# Altium project PDB_01.PrjPcb
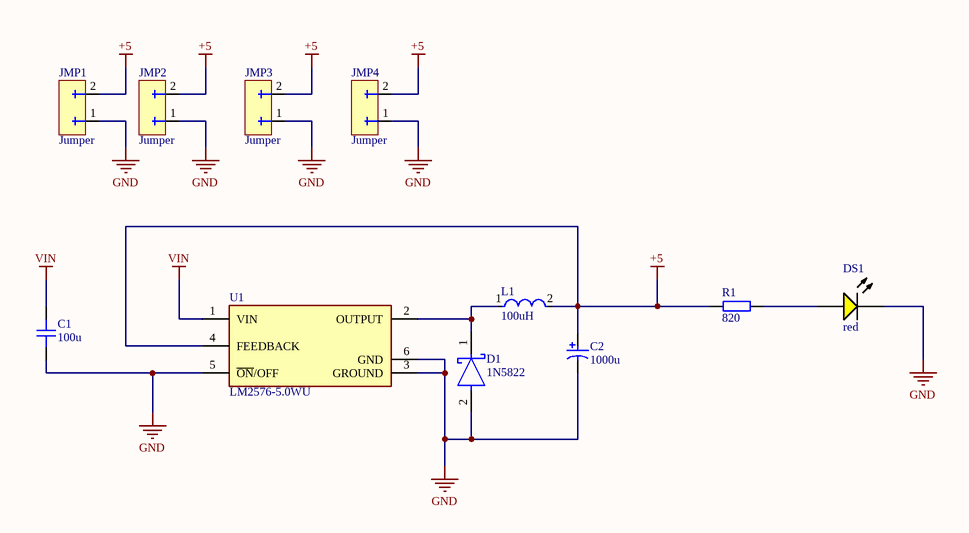
[diagram p0: Sheet2.SchDoc]
1 sheet, 11 parts. Net scope: global (net labels, ports and power ports of the same name join across sheets).
Board file: PCB1.PcbDoc

## Sheet Sheet2.SchDoc
size A4; SheetNumber: 1; SheetTotal: 1

### Parts
C1  100u  [CAP_1206]
C2  1000u  [NIC-UCL-10x13.5-2_V]
D1  1N5822  [FP-DO-201AD-MFG]
DS1  red  [LUMX-SML-LX1206YC-TR_V]
JMP1  Jumper  [JMP2_TH]
JMP2  Jumper  [JMP2_TH]
JMP3  Jumper  [JMP2_TH]
JMP4  Jumper  [JMP2_TH]
L1  100uH  [FP-IHLP-6767GZ-FP_3_825x1-MFG]
R1  820  [RES_1206]
U1  LM2576-5.0WU  [FP-TO263-5LD-PL-1-MFG]

### Nets
+5: C2.1 JMP1.2 JMP2.2 JMP3.2 JMP4.2 L1.2 R1.1 U1.4(FEEDBACK)
GND: C1.1 C2.2 D1.2(A) DS1.2(K) JMP1.1 JMP2.1 JMP3.1 JMP4.1 U1.3(GROUND) U1.5(~{ON}/OFF) U1.6(GND)
VIN: C1.2 U1.1(VIN)
NetD1_1: D1.1(C) L1.1 U1.2(OUTPUT)
NetDS1_1: DS1.1(A) R1.2

### Library data of the parts
C1 = CAP_1206: Capacitor SMD 1206; Manufacturer: *; Manufacturer Part Number: *; Distributor Link: *; LCSC: *; Rating: *; Dielectric: *
C2 = CMP-0926-00001-1: Aluminum Electrolytic Capacitor, Low Impedance, 1000 uF +/- 20%, 16 V, -55 to 105 degC, 2-Pin 10.3 x 10.3 x 13.5 mm SMD, RoHS, Reel; Manufacturer: Nichicon; PartNumber: UCL1C102MNL1GS; Rated Voltage: 16 V; Capacitance Tolerance: +/- 20%; Rated Capacitance: 1000 uF; Polarity Type: Polar; Impedance: 0.06 ohm; Leakage Current: 160 uA; Rated Ripple Current (at 100 kHz): 1190 mA; PackageReference: UCL-10x13.5-2; Mounting Technology: Surface Mount; PackageDescription: 2-Pin SMD, Body 10.3 x 10.3 mm, Height 14.3 mm; ComponentLink1Description: Manufacturer URL; ComponentLink2Description: Datasheet; RoHS: TRUE; DatasheetVersion: Sep-13; ComponentLink2URL: http://nichicon-us.com/english/products/pdfs/e-cl.pdf; ComponentLink1URL: www.nichicon.com; Packing: Reel; Category Temperature Range: -55 to 105 degC
D1 = CMP-12187-000025-1: DIODE SCHOTTKY 40V 3A DO201AD; Manufacturer: STMicroelectronics; Max Junction Temp: +150°C; Peak Reverse Current: 2mA; Max Surge Forward Current: 80A; Temperature Range High: +150°C; Automotive: No; RoHS: TRUE; ComponentLink2Description: Datasheet; Manufacturer Part Number: 1N5822; Lead Free: Yes; Octopart: https://octopart.com/1n5822-stmicroelectronics-323225; Device Class L2: Diodes; Max Repetitive Reverse Voltage: 40V; Temperature: to +150°C; Height: 5.3mm; Category: Diode; Digikey Description: DIODE SCHOTTKY 40V 3A DO201AD; ComponentLink2URL: https://www.st.com/resource/en/datasheet/1n5822.pdf; Device Class L3: Schottky Diodes; Device Class L1: Discrete Semiconductors; Forward Current: 3A; Mouser Description: Schottky Diodes & Rectifiers Vr/40V Io/3A BULK; Package: DO-201AD
DS1 = CMP-2000-07124-1: Yellow LED, Water Clear Len, 585 nm, 2.1 V, -40 to 85 degC, 2-Pin SMD, RoHS, Tape and Reel; Manufacturer: Lumex; Product Training Modules: LEDsBenefitsofCustomLEDandLCDTechnology; Millicandela Rating: 6mcd; Catalog Drawings: SML-LX1206SeriesTopSML-LX1206SeriesSideSML-LX1206SeriesBottomSML-LX1206SeriesFootprint; Wavelength - Peak: 585nm; Other Names: 67-1358-2LU60357TRSMLLX1206YCTR; Lens Style/Size: RectanglewithFlatTop; Current - Test: 20mA; Lens Color: Colorless; Viewing Angle: 160°; Voltage - Forward (Vf) (Typ): 2.1V; Online Catalog: SML-LX1206RectanglewithFlatTop1206PackageLEDs; Mounting Type: SurfaceMount; Package Description: 2-Pin Surface Mount Device, Body 3.2 x 1.5 mm; Datasheet Version: Rev. K, 08/2012; Features: -; Color: Yellow; RoHS Information: RoHSCertofCompliance; Package Reference: SML-LX1206YC-TR; Supplier Device Package: 1206; Standard Package: 3,000; Series: -; Wavelength - Dominant: -; Package / Case: 1206(3216Metric); Mounting Technology: SurfaceMount; Height (Max): 1.10mm; Lens Transparency: Clear; Datasheet URL: http://www.lumex.com/content/files/ProductAttachment/SML-LX1206YC-TR.pdf; Family: LEDIndication-Discrete; Manufacturer URL: http://www.lumexinstruments.com/; Packaging: Tape&Reel(TR); Category: Optoelectronics; Size / Dimension: 3.20mmLx1.60mmW
JMP1-JMP4 = JMP2_TH: Jumper 2 Pins Through-Hole DO NOT PLACE
L1 = CMP-02424-000256-1: Commercial Inductors, Low DCR Series 100uH 5A 110mΩ 20%; DC Resistance (DCR): 110mR; Saturation Current: 4A; Test Frequency: 100kHz; Core Material: Metal; Self Resonant Frequency: 2.1MHz; Shielding: Shielded; Number of Pins: 2; Termination: SMD/SMT; Case/Package: 6767; Package Quantity: 200; Max Operating Temperature: 125°C; Max DC Current: 4A; Min Operating Temperature: -55°C; Military Standard: Not; Height: 7mm; Tolerance: 20%; Width: 0.675inch; Radiation Hardening: No; Current Rating: 5A; Depth: 17.15mm; RMS Current (Irms): 5A; Mount: Surface Mount; Height - Seated (Max): 0.276inch; Length: 17.15mm; Inductance: 100uH; Inductance Tolerance: 20%; Lead Free: Lead Free; Packaging: Tape and Reel
R1 = RES_1206: Resistor SMD 1206; Manufacturer: *; Manufacturer Part Number: *; Distributor Link: *; LCSC: *
U1 = CMP-06325-000018-1: IC REG BUCK 5V 3A TO263-5; Number of Outputs: 1; Synchronous Rectifier: No; Output Type: Fixed; Min Input Voltage: 4V; Output Configuration: Positive; Switching Frequency: 52kHz; Max Input Voltage: 40V; Packaging: Bulk; REACH SVHC: No SVHC; Max Operating Temperature: 125°C; Case/Package: TO-263-6; Nominal Output Voltage: 5V; Min Output Voltage: 5V; Lead Free: Lead Free; Mount: Surface Mount; Output Current: 3A; Output Voltage: 5V; Number of Pins: 5; Min Operating Temperature: -40°C